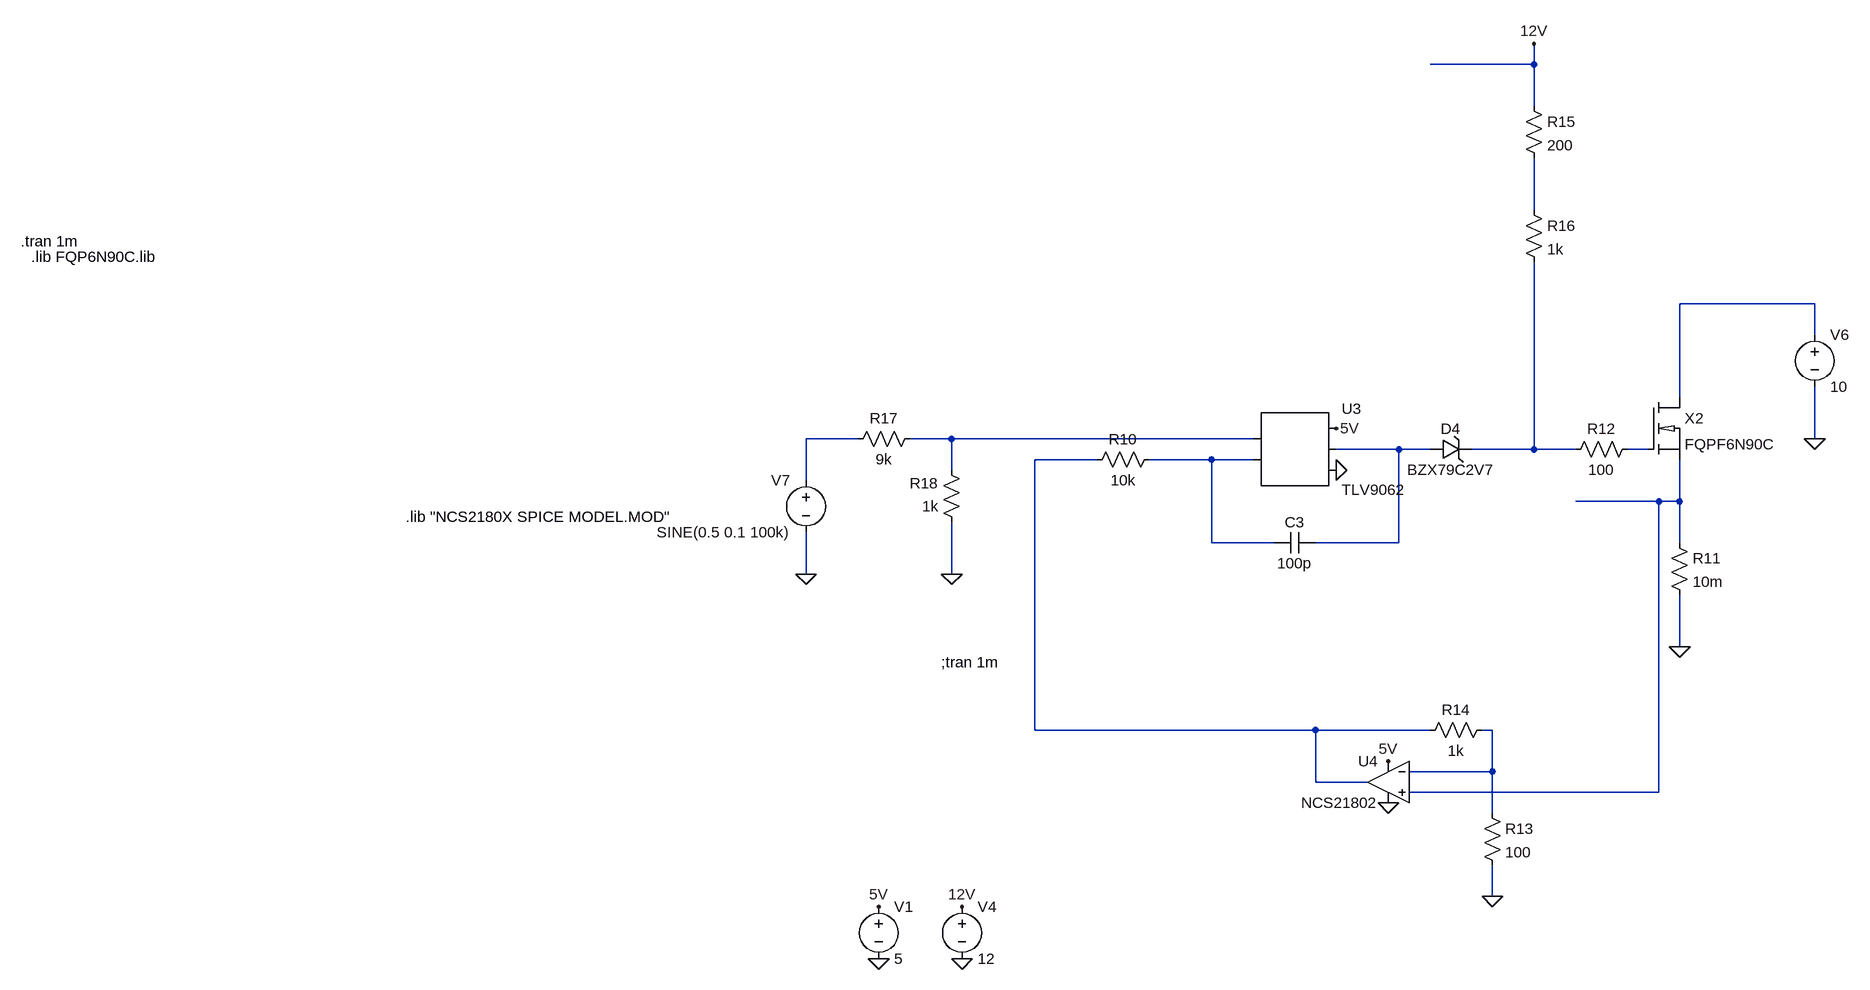
[diagram p0: schematic ncsc.asc]
ncsc.asc, the LTspice schematic file:
Version 4
SHEET 1 3992 1012
WIRE 3504 -384 3504 -416
WIRE 3504 -384 3344 -384
WIRE 3504 -320 3504 -384
WIRE 3504 -160 3504 -240
WIRE 3936 -16 3728 -16
WIRE 3936 32 3936 -16
WIRE 3728 128 3728 -16
WIRE 2464 192 2384 192
WIRE 2608 192 2544 192
WIRE 3072 192 2608 192
WIRE 3936 192 3936 112
WIRE 3296 208 3200 208
WIRE 3344 208 3296 208
WIRE 3504 208 3504 -80
WIRE 3504 208 3408 208
WIRE 3568 208 3504 208
WIRE 3680 208 3648 208
WIRE 2832 224 2736 224
WIRE 3008 224 2912 224
WIRE 3072 224 3008 224
WIRE 2608 240 2608 192
WIRE 2384 256 2384 192
WIRE 3696 288 3568 288
WIRE 3728 288 3728 224
WIRE 3728 288 3696 288
WIRE 3008 352 3008 224
WIRE 3104 352 3008 352
WIRE 3296 352 3296 208
WIRE 3296 352 3168 352
WIRE 3728 352 3728 288
WIRE 2384 400 2384 336
WIRE 2608 400 2608 320
WIRE 3728 512 3728 432
WIRE 2736 640 2736 224
WIRE 3168 640 2736 640
WIRE 3344 640 3168 640
WIRE 3440 640 3424 640
WIRE 3440 704 3440 640
WIRE 3440 704 3312 704
WIRE 3168 720 3168 640
WIRE 3248 720 3168 720
WIRE 3696 736 3696 288
WIRE 3696 736 3312 736
WIRE 3440 768 3440 704
WIRE 3440 896 3440 848
FLAG 2496 912 5V
FLAG 2496 992 0
FLAG 2624 912 12V
FLAG 2624 992 0
FLAG 3200 240 0
FLAG 3200 176 5V
FLAG 3728 512 0
FLAG 3936 192 0
FLAG 2384 400 0
FLAG 3504 -416 12V
FLAG 3440 896 0
FLAG 3280 752 0
FLAG 3280 688 5V
FLAG 2608 400 0
SYMBOL voltage 2496 896 R0
WINDOW 123 0 0 Left 0
WINDOW 39 0 0 Left 0
SYMATTR InstName V1
SYMATTR Value 5
SYMBOL voltage 2624 896 R0
WINDOW 123 0 0 Left 0
WINDOW 39 0 0 Left 0
SYMATTR InstName V4
SYMATTR Value 12
SYMBOL AutoGenerated\\TLV9062 3136 208 R0
SYMATTR InstName U3
SYMBOL res 2928 208 R90
WINDOW 0 0 56 VBottom 2
WINDOW 3 32 56 VTop 2
SYMATTR InstName R10
SYMATTR Value 10k
SYMBOL cap 3168 336 R90
WINDOW 0 0 32 VBottom 2
WINDOW 3 32 32 VTop 2
SYMATTR InstName C3
SYMATTR Value 100p
SYMBOL res 3712 336 R0
SYMATTR InstName R11
SYMATTR Value 10m
SYMBOL voltage 3936 16 R0
WINDOW 123 0 0 Left 0
WINDOW 39 0 0 Left 0
SYMATTR InstName V6
SYMATTR Value 10
SYMBOL voltage 2384 240 M0
WINDOW 123 0 0 Left 0
WINDOW 39 0 0 Left 0
SYMATTR InstName V7
SYMATTR Value SINE(0.5 0.1 100k)
SYMBOL n_channel_mosfet 3680 128 R0
SYMATTR InstName X2
SYMBOL res 3664 192 R90
WINDOW 0 0 56 VBottom 2
WINDOW 3 32 56 VTop 2
SYMATTR InstName R12
SYMATTR Value 100
SYMBOL zener 3344 224 R270
WINDOW 0 32 32 VTop 2
WINDOW 3 0 32 VBottom 2
SYMATTR InstName D4
SYMATTR Value BZX79C2V7
SYMATTR Description Diode
SYMATTR Type diode
SYMBOL OpAmps\\opamp2 3280 656 M0
SYMATTR InstName U4
SYMATTR Value NCS21802
SYMBOL res 3424 752 R0
SYMATTR InstName R13
SYMATTR Value 100
SYMBOL res 3440 624 R90
WINDOW 0 0 56 VBottom 2
WINDOW 3 32 56 VTop 2
SYMATTR InstName R14
SYMATTR Value 1k
SYMBOL res 3488 -336 R0
SYMATTR InstName R15
SYMATTR Value 200
SYMBOL res 3488 -176 R0
SYMATTR InstName R16
SYMATTR Value 1k
SYMBOL res 2560 176 R90
WINDOW 0 0 56 VBottom 2
WINDOW 3 32 56 VTop 2
SYMATTR InstName R17
SYMATTR Value 9k
SYMBOL res 2624 336 R180
WINDOW 0 36 76 Left 2
WINDOW 3 36 40 Left 2
SYMATTR InstName R18
SYMATTR Value 1k
TEXT 1176 -112 Left 2 !.tran 1m
TEXT 1192 -88 Left 2 !.lib FQP6N90C.lib
TEXT 1768 312 Left 2 !.lib "NCS2180X SPICE MODEL.MOD"
TEXT 2592 536 Left 2 !;tran 1m

The netlist it stands for:
* ncsc.asc
V1 5V 0 5
V4 12V 0 12
* U3: TLV9062 (symbol AutoGenerated\TLV9062 not available, pins judged from their places): pin1=N004 pin2=N009 pin3=5V pin4=N005 pin5=0
R10 N009 N008 10k
C3 N005 N009 100p
R11 N010 0 10m
V6 N002 0 10
V7 N003 0 SINE(0.5 0.1 100k)
XX2 N002 N007 N010 FQPF6N90C  ; pins D G S
R12 N007 N006 100
D4 N005 N006 BZX79C2V7
XU4 N010 N011 5V 0 N008 NCS21802  ; pins In+ In- V+ V- OUT
R13 N011 0 100
R14 N011 N008 1k
R15 12V N001 200
R16 N001 N006 1k
R17 N004 N003 9k
R18 0 N004 1k
.model D D
.lib standard.dio
.tran 1m
.lib FQP6N90C.lib
.lib "NCS2180X SPICE MODEL.MOD"
;tran 1m
.lib FQP6N90C.lib
.backanno
.end